# Altium schematic sheet Sheet1.SchDoc
size A; DrawnBy: John Ulm; DocumentNumber: Reciever; Revision: 1; SheetNumber: 1; SheetTotal: 1
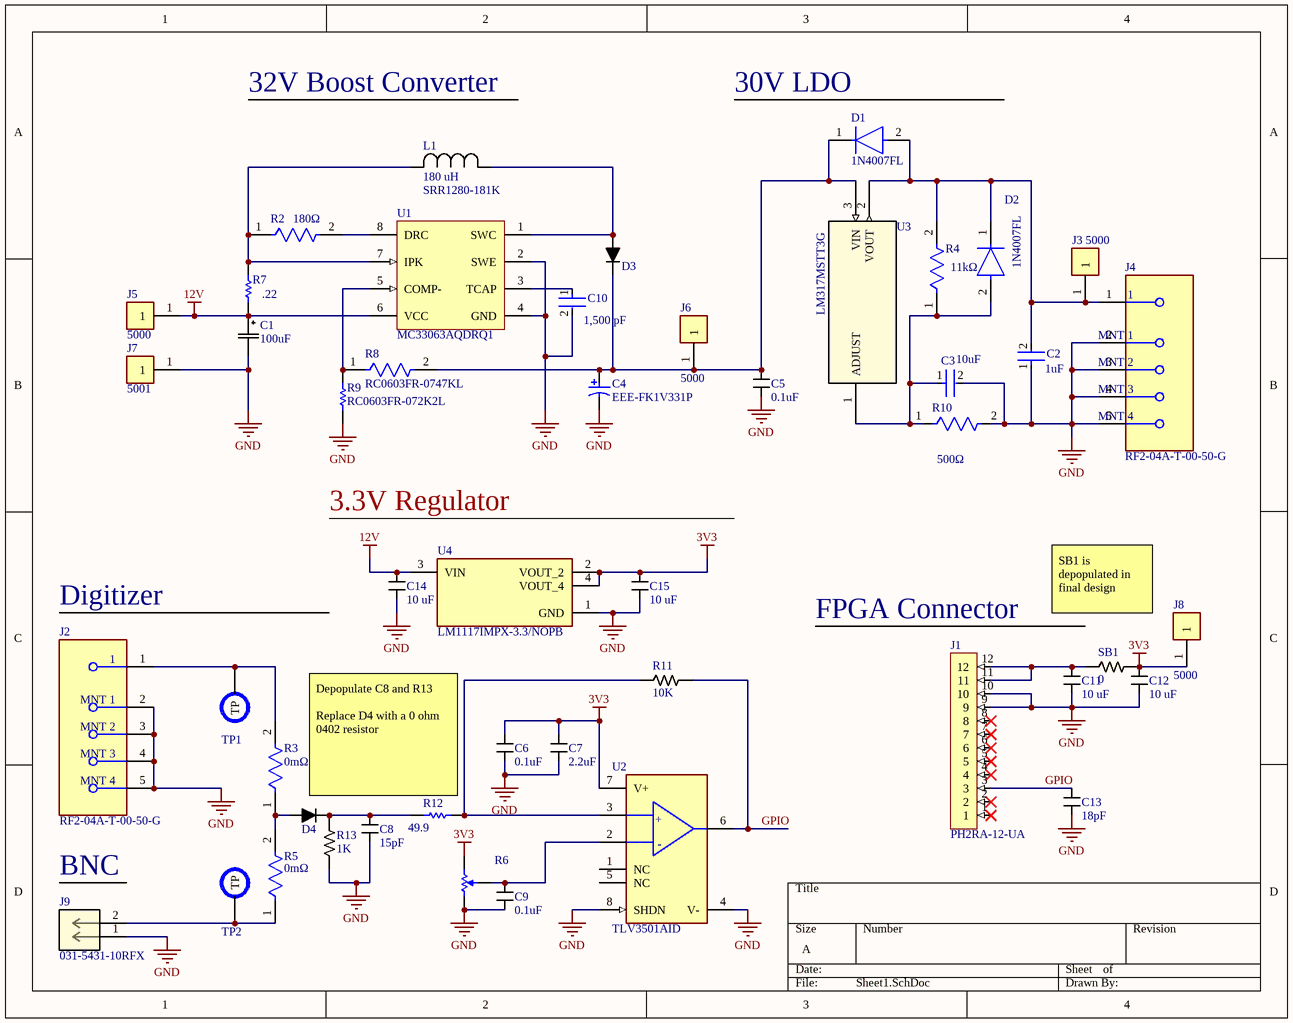
[diagram p0: Sheet1.SchDoc]

## Parts
C1  value 100uF  [PCAP_8x5.4-ELECT_NCA]  (hidden comment: 100uF electrolytic 35 V)
C2  Capacitance: 1uF  [FP-0603-L_1_6_0_1-W_0_8_0-IPC_A]  (hidden comment: UMK107BJ105KA-T)
C3  Capacitance: 10uF  [FP-GRM188-0_2-IPC_C]  (hidden comment: GRM188R6YA106MA73D)
C4  EEE-FK1V331P  [PNSC-EEE-FK1V331P_L]
C5  value 0.1uF  [CAPACITOR_0805]  (hidden comment: 100nF Ceramic 50V)
C6  value 0.1uF  [CAPACITOR_0603]  (hidden comment: 100nF Ceramic 25V)
C7  value 2.2uF  [CAPACITOR_0402]  (hidden comment: 2.2uF Ceramic 35V)
C8  value 15pF  [CAPACITOR_0402]  (hidden comment: 15pF Ceramic 50V)
C9  value 0.1uF  [CAPACITOR_0603]  (hidden comment: 100nF Ceramic 25V)
C10  value 1,500 pF  [FP-C0603C-CF-MFG]  (hidden comment: C0603C152F1GACTU)
C11  Value (uF): 10 uF  [CAPACITOR_0603]  (hidden comment: 10uF Ceramic 6.3V)
C12  Value (uF): 10 uF  [CAPACITOR_0603]  (hidden comment: 10uF Ceramic 6.3V)
C13  value 18pF  [CAPACITOR_0603]  (hidden comment: 18pF Ceramic 50V)
C14  Value (uF): 10 uF  [CAPACITOR_0603]  (hidden comment: 10uF Ceramic 6.3V)
C15  Value (uF): 10 uF  [CAPACITOR_0603]  (hidden comment: 10uF Ceramic 6.3V)
D1  1N4007FL  [FP-1N4007FL-MFG]
D2  1N4007FL  [FP-1N4007FL-MFG]
D3  STPS140Z  [SOD-123]  (value not drawn)
D4  BAR9002ELE6327XTMA1  [DIODE_0402]  (value not drawn)
J1  PH2RA-12-UA  [PH2RA-12-UA-Footprint-1]
J2  RF2-04A-T-00-50-G  [FP-RF2-04A-T-00-50-G-MFG]
J3  5000  [FP-5000-MFG]
J4  RF2-04A-T-00-50-G  [FP-RF2-04A-T-00-50-G-MFG]
J5  5000  [FP-5000-MFG]
J6  5000  [FP-5000-MFG]
J7  5001  [FP-5001-MFG]
J8  5000  [FP-5000-MFG]
J9  031-5431-10RFX  [031-5431-10RFX-Footprint-1]
L1  SRR1280-181K  value 180 uH  [SRR1280]
R2  Resistance: 180Ω  [FP-CRGCQ0603-IPC_C]  (hidden comment: CRGCQ0603F180R)
R3  Resistance: 0mΩ  [FP-RMCF0603-MFG]  (hidden comment: RMCF0603ZT0R00)
R4  Resistance: 11kΩ  [FP-ERA2A-MFG]  (hidden comment: ERA-2AEB113X)
R5  Resistance: 0mΩ  [FP-RMCF0603-MFG]  (hidden comment: RMCF0603ZT0R00)
R6  TC33X-2-103E  [BOUR-TC33X-2_V]  (value not drawn)
R7  value .22  [RESC1608X55X30NL15T15]  (hidden comment: ERJ-3RQFR22V)
R8  RC0603FR-0747KL  [FP-RC0603FR-0747KL-MFG]
R9  RC0603FR-072K2L  [RESC1608X55X25LL10T15]
R10  RT0603BRC07500RL  [RESC16080X45_RT0603-0_55_MFG]  (value not drawn)
R11  Value  (Ohms): 10K  [RESISTOR_0402]  (hidden comment: 10k Ohm 1% 1/16W)
R12  value 49.9  [RESC1005X40X25LL05T10]  (hidden comment: RC0402FR-0749R9L)
R13  Value  (Ohms): 1K  [RESISTOR_0603]  (hidden comment: 1k Ohm 5% 1/8W)
SB1  value 0  [RESISTOR_1206]  (hidden comment: JUMPER_0_1206)
TP1  PCB Test Point  [TESTPOINT_1.2MM]  (value not drawn)  (no BOM)
TP2  PCB Test Point  [TESTPOINT_1.2MM]  (value not drawn)  (no BOM)
U1  MC33063AQDRQ1  [D0008A_L]
U2  TLV3501AID  [FP-D0008A-IPC_C]
U3  LM317MSTT3G  [SOT223-3]
U4  LM1117IMPX-3.3/NOPB  [SOT-223-4]

## Nets
3V3: C6.1 C7.1 C12.1 C15.1 J8.1 R6.3 SB1.1 U2.7(V+) U4.2(VOUT_2) U4.4(VOUT_4)
12V: C1.1 C14.1 J5.1 R7.1 U1.6(VCC) U4.3(VIN)
GND: C1.2 C2.1 C3.2 C4.2 C5.2 C6.2 C7.2 C8.2 C9.2 C10.2 C11.2 C12.2 C13.2 C14.2 C15.2 J1.9 J1.10 J2.2(MNT_1) J2.3(MNT_2) J2.4(MNT_3) J2.5(MNT_4) J4.2(MNT_1) J4.3(MNT_2) J4.4(MNT_3) J4.5(MNT_4) J7.1 J9.1 R6.1 R9.1 R10.2 R13.2 U1.2(SWE) U1.4(GND) U2.4(V-) U2.8(SHDN) U4.1(GND)
GPIO: C13.1 J1.3 R11.1 U2.6(OUT)
NetC2_2: C2.2 D1.2(A) D2.1(C) J3.1 J4.1 R4.2 U3.2(VOUT)
NetC3_1: C3.1 D2.2(A) R4.1 R10.1 U3.1(ADJUST)
NetC4_1: C4.1 C5.1 D1.1(C) D3.2 J6.1 R8.2 U3.3(VIN)
NetC8_1: C8.1 D4.2 R12.1 R13.1
NetC9_1: C9.1 R6.2 U2.2(-IN)
NetC10_1: C10.1 U1.3(TCAP)
NetC11_1: C11.1 J1.11 J1.12 SB1.2
NetD3_1: D3.1 L1.1 U1.1(SWC)
NetD4_1: D4.1 R3.1 R5.2
NetJ2_1: J2.1 R3.2 TP1.TP
NetJ9_2: J9.2 R5.1 TP2.TP
NetL1_2: L1.2 R2.1 R7.2 U1.7(IPK)
NetR2_2: R2.2 U1.8(DRC)
NetR8_1: R8.1 R9.2 U1.5(COMP-)
NetR11_2: R11.2 R12.2 U2.3(+IN)

Not connected (* = marked no-connect by the designer): J1 1* 2* 4* 5* 6* 7* 8*; U2 1(NC) 5(NC)

## Notes on the sheet
- 32V Boost Converter
- (near D1) 30V LDO
- 3.3V Regulator
- Digitizer
- (near J1) FPGA Connector
- SB1 is depopulated in final design
- Depopulate C8 and R13
  Replace D4 with a 0 ohm 0402 resistor
- (near J9) BNC
- (in symbol CMP-04896-000133-1) +; -

## Library data of the parts
C1 = CAP ALUM 100UF 20% 35V SMD: 100 µF 35 V Aluminum Electrolytic Capacitors Radial, Can - SMD 1000 Hrs; Mfr_Name: Nichicon; Manufacturer_Part_Number: UCB1V0R1MCL1GS; Type: DEV; Made by: Tyson Nguyen; Copyright: Copyright (C) 2022 Ultra Librarian. All rights reserved.; RefDes: RefDes; Supplier 1: Mouser; Supplier Part Number 1: 667-EEE-FT1V101AP
C2 = CMP-2000-05447-3: None; Tolerance: 10%; Voltage Rating: 50V; Dielectric: X5R; Height: 0.8mm; Depth: 0.8mm; Number of Pins: 2; Length: 1.6mm; Thickness: 0.035inch; Contact Plating: Nickel; Radiation Hardening: No; Package Quantity: 1; Case/Package: 0603; Halogen Free: Halogen Free; RoHS Compliant: Yes; Termination: SMD/SMT; Max Operating Temperature: 85°C; Min Operating Temperature: -55°C; Case Code (Metric): 1608; Construction: Flat; Voltage Rating (DC): 50V; Packaging: Tape and Reel; Series: M; Case Code (Imperial): 0603; Width: 0.031inch; Mount: Surface Mount
C3 = CMP-06035-045466-1: Chip Multilayer Ceramic Capacitors for General Purpose, 0603, 10uF, X5R, 15%, 20%, 35V; Case Code (Imperial): 0603; Voltage Rating (DC): 35V; Width: 0.031inch; Dielectric: X5R; Voltage Rating: 35V; Min Operating Temperature: -55°C; Thickness: 0.039inch; Mount: Surface Mount; Case/Package: 0603; Length: 0.063inch; Max Operating Temperature: 85°C; Packaging: Tape and Reel; Tolerance: 20%; Case Code (Metric): 1608
C4 = CMP-2000-06212-1: Aluminum Electrolytic Capacitor, 330 uF, 35 V, -55 to 105 degC, 2-Pin CAPAE, RoHS, Tape and Reel; Manufacturer: Panasonic; Capacitance: 330µF; Type: Can; Impedance: 0.08O; Ripple Current: 850mA; Lifetime@Temperature: 2000Hrs@105°C; Rated Voltage: 35V; Datasheet Version: 07/2008; Manufacturer URL: http://www.panasonic.com/; Package Description: 2-Pin Capacitor Aluminum Electrolytic, Body 10.3 x 10.3 mm, Height 10.5 mm; Case Size/Dimension: Ø10x10.2mm; Datasheet URL: https://datasheet.ciiva.com/29313/443481-da-01-en-smd-elko-vfk-g-330-uf-35v-29313592.pdf; Series: FK; Mounting Technology: SurfaceMount; Package Reference: EEE-FK1V331P; Operating Temp-Max: 105°C; Operating Temp Range: -55to+105°C
C5 = CAPACITOR_0.1uF_0805: Cap 100nF 50V +/-10% / Ceramic 0805; Made By: Robert Pafford; Tolerance: +/- 10%; Voltage: 50V; Supplier 1: Newark; Supplier Part Number 1: 38AH3645
C6 C9 = CAPACITOR_0.1uF_0603_25V: Cap 100nF 25V +/-10% / Ceramic 0603; Voltage: 6.3V; Made By: Flip B; ComponentLink1Description: Datsheet; ComponentLink1URL: https://www.mouser.com/datasheet/2/212/KEM_C1002_X7R_SMD-1102033.pdf; Tolerance: +/- 10%; Supplier 1: Digikey; Supplier Part Number 1: 1276-1006-1-ND
C7 = CAPACITOR_2.2uF_0402: Cap 2.2uF 35V +/-10% / Ceramic 0402; Made By: Flip B; Tolerance: +/- 10%; Voltage: 35V; Supplier 1: Digi-Key; Supplier Part Number 1: 445-9028-1-ND
C8 = CAPACITOR_0.000015uF_0402: CAP CER 15PF 50V C0G/NP0 0402; Tolerance: +/- 5%; Made By: Robert Pafford; Voltage: 50V; Supplier 1: Newark; Supplier Part Number 1: 82AC9245
C10 = CMP-1035-01965-2: CAP CER 1500PF 100V NP0 0603; Manufacturer: KEMET; Material: Ceramic; Tolerance: 0.01; Automotive Grade: Grade 1; Temperature Coefficient: 30ppm/°C; Temperature Characteristic: C0G; Automotive: Yes; Temperature Range High: +125°C; ComponentLink2Description: Datasheet; Category: Cap; Octopart: https://octopart.com/c0603c152f1gactu-kemet-19049933; Device Class L1: Passive Components; Device Class L3: Ceramic Capacitors; Temperature: -55°C to +125°C; Mouser Description: Multilayer Ceramic Capacitors MLCC - SMD/SMT 100volts 1500pF 1% C0G; Package: C0603C-CF; Device Class L2: Capacitors; Height: 0.87mm; Digikey Description: CAP CER 1500PF 100V NP0 0603; Temperature Range Low: -55°C; Lead Free: Yes; Voltage Rating: 100 V; RoHS: TRUE; Capacitance: 1,500 pF; Manufacturer Part Number: C0603C152F1GACTU; ComponentLink2URL: https://api.kemet.com/component-edge/download/datasheet/C0603C100J5GACAUTO.pdf
C11 C12 C14 C15 = CAPACITOR_10uF_0603: Cap 10uF 6.3V +/-20% / Ceramic 0603; Made By: Flip B; ComponentLink1Description: Digikey; ComponentLink1URL: https://www.digikey.com/en/products/detail/samsung-electro-mechanics/CL10A106MQ8NNNC/3886777; Supplier 1: Digi-Key; Supplier Part Number 1: 1276-1119-1-ND; Tolerance: +/- 20%; Voltage: 6.3V
C13 = CAPACITOR_0.000018uF_0603: Cap 18pF 50V +/-5% / Ceramic 0603; Made By: Flip B; ComponentLink1Description: Datsheet; ComponentLink1URL: https://www.mouser.com/datasheet/2/212/KEM_C1002_X7R_SMD-1102033.pdf; Tolerance: +/- 5%; Voltage: 50V; Supplier 1: Digi-Key; Supplier Part Number 1: 311-1061-1-ND
D1 D2 = CMP-10078-122641204-1: 1N4007FL Diode Gen Purp 1KV 1A SOD123FL; Capacitance: 6pF; Max Junction Temperature (Tj): 150°C; Peak Reverse Current: 5µA; Max Forward Surge Current (Ifsm): 30A; Reverse Voltage: 1kV; Max Operating Temperature: 150°C; Height: 1.1mm; Min Operating Temperature: -55°C; Forward Current: 1A; Max Repetitive Reverse Voltage (Vrrm): 1kV; NexarPartId: 122641204
D3 = STPS140Z: DIODE SCHOTTKY 40V 1A SOD123; Supplier 1: DigiKey; Supplier Part Number 1: 497-7546-1-ND
D4 = RF Diode 80V 100mA: RF Diode PIN - Single 80V 100 mA 250 mW PG-TSLP-2-19; Forward Current: 100mA; Voltage - Peak Reverse: 80V; Package: 0402
J1 = CMP-002-00071-1: Conn Unshrouded Header HDR 12 POS 2.54mm Solder RA Top Entry Thru-Hole Bag; Min Operating Temperature: -40°C; Max Operating Temperature: 105°C; Pins: 12
J2 J4 = CMP-42753-000002-1: CONN SMA JACK STR 50 OHM PCB
J3 J5 J6 J8 = CMP-002-00074-1: Cable Wrap, 1/2 Inch, Polyethylene, Natural, 50 Ft, Spirap Series; Mounting Technology: PCB, Through Hole
J7 = CMP-002-00076-1: Test Point, Mini, Thm, Pc, .300 L, .100 Od, Heat Resistant Nylon 46, Black; Pins: 1; Mounting Technology: PCB, Through Hole
J9 = CMP-002-00073-1: RF BNC Connector, Female, Panel Mount, Board And Panel Mount, Solder Terminal, Jack; Voltage Rating: 500V; Connector Type: Receptacle; Gender: Male; Mounting Technology: Bulkhead, PCB, Panel, Through Hole; Max Operating Temperature: 85°C; Min Operating Temperature: -55°C
L1 = SRR1280-181K: FIXED IND 180UH 1.75A 300 MOHM; Supplier 1: DigiKey; Supplier Part Number 1: SRR1280-181KCT-ND; R: 300 mOhm
R2 = CMP-03211-005520-1: CRGCQ 0603 180R 1%; Manufacturer: TE Connectivity; Power Rating: 0.1W; Tolerance: 0.01; Voltage Rating: 75V; Temperature Coefficient: ±100ppm/°C; Value: 180Ω; Device Class L1: Passive Components; Category: Res; RoHS: TRUE; Octopart: https://octopart.com/crgcq0603f180r-te+connectivity-91018047; Ipc Land Pattern Name: RESC16080X45; Digikey Description: CRGCQ 0603 180R 1%; Ambient Temperature Range High: +70°C; Device Class L2: Resistors; Composition: Thick Film; Lead Free: Yes; Temperature: -55°C to +155°C; ComponentLink2Description: Datasheet; Manufacturer Part Number: CRGCQ0603F180R; Height: 0.55mm; Device Class L3: Chip SMD Resistors; Package: CRGCQ0603; Temperature Range High: +155°C; ComponentLink2URL: https://www.te.com/commerce/DocumentDelivery/DDEController?Action=showdoc&DocId=Data+Sheet%7F1773204-3%7F1%7Fpdf%7FEnglish%7FENG_DS_1773204-3_1.pdf%7F4-2176339-520; Series: CRGCQ; Temperature Range Low: -55°C
R3 R5 = CMP-26527-000011-1: RES 0 OHM JUMPER 1/10W 0603; Manufacturer: Stackpole; Power Rating: 0.1W; Voltage Rating: 75V; Automotive Grade: Grade 0; Value: 0mΩ; Series: RMCF; Manufacturer Part Number: RMCF0603ZT0R00; Device Class L1: Passive Components; Device Class L3: Chip SMD Resistors; Octopart: https://octopart.com/rmcf0603zt0r00-stackpole+electronics-19213618; Temperature: -55°C to +155°C; Lead Free: Yes; ComponentLink2URL: https://www.seielect.com/catalog/sei-rmcf_rmcp.pdf; Height: 0.55mm; Composition: Thick Film; Package: RMCF0603; Automotive: Yes; Temperature Range High: +155°C; Ipc Land Pattern Name: RESC15580X45; Digikey Description: RES 0 OHM JUMPER 1/10W 0603; RoHS: TRUE; ComponentLink2Description: Datasheet; Temperature Range Low: -55°C; Category: Res; Device Class L2: Resistors
R4 = CMP-2002-05776-2: NexarPartId: 42798195; Voltage Rating: 25V; Power Rating: 63mW; Tolerance: 0.1%; Temperature Coefficient: 25ppm/°C; Packaging: Cut Tape; Radiation Hardening: No; Width: 500µm; Lead Free: Lead Free; Features: Automotive AEC-Q200; Max Power Dissipation: 63mW; Height: 406.4µm; REACH SVHC: No SVHC; Number of Terminations: 2; Case Code (Imperial): 0402; Lifecycle Status: Production; Length: 1mm; Contact Plating: Tin; RoHS: Compliant; Schedule B: 8533210045, 8533210045; Mount: Surface Mount; Voltage Rating (DC): 25V; Min Operating Temperature: -55°C; Case Code (Metric): 1005; Military Standard: Not; Composition: Metal Film, Thin Film; Case/Package: 0402; Depth: 500µm; Max Operating Temperature: 155°C
R6 = CMP-009-00060-2: Trimming Potentiometer, 10000 Ohm, -40 to 100 degC, 3-Pin SMD, RoHS, Tape and Reel; Manufacturer: Bourns; Tolerance: 25%; Power: 100mW; Resistance: 10k; Max Operating Temperature: 120°C; Package Description: 3-Pin Surface Mount Device, Body 3.8 x 3.6 mm; Datasheet Version: Aug-16; RoHS Compliant: True; Mounting Technology: SM; Package Quantity: 2500; Manufacturer URL: http://www.bourns.com/; Datasheet URL: http://www.bourns.com/docs/Product-Datasheets/TC33.pdf; Case/Package: TC33X-2; Package Reference: TC33X-2; Composition: Potentiometer; Packaging: TapeandReel; Min Operating Temperature: -40°C
R7 = CMP-2000-00853-1: Manufacturer: Panasonic; Part Number: ERJ-3RQFR22V
R8 = CMP-1659-00055-2: RES SMD 47K OHM 1% 1/10W 0603; Voltage Rating: 50V; Temperature Coefficient: 100ppm/°C; Max Power Dissipation: 100mW; Resistance: 47kR; Voltage Rating (DC): 50V; Min Operating Temperature: -55°C; Packaging: Tape and Reel; Features: Moisture Resistant; Termination: SMD/SMT; Technology: THICK FILM; Lead Free: Lead Free; Max Operating Temperature: 155°C; Width: 0.031inch; Case Code (Metric): 1608; Tolerance: 1%; Package Quantity: 1; Resistor Type: Thick Film; RoHS Compliant: Yes; Case/Package: 0603; Case Code (Imperial): 0603; Resistance Tolerance: 1%; Length: 0.063inch; Series: RC; Number of Pins: 2; Power Rating: 100mW; Number of Terminations: 2; Construction: Rectangular; Height: 0.022inch; Military Standard: Not; Size Code: 0603; Depth: 0.8mm
R9 = CMP-2000-06934-1: Thick Film Resistor, 2.2 KOhm, 100 mW, 50 V, +/- 1%, -55 to 155 degC, 2-Pin SMD (0603), RoHS, Tape and Reel; Manufacturer: Yageo; Resistance: 2.2kOhms; Temperature Coefficient: 100PPM/C; Voltage Rating: 50V; Power Rating: 100mW; Tolerance: 1%; Datasheet Version: Rev. 7, 05/2017; Case Code - mm: 1608; Series: RC; Mounting Technology: SurfaceMount; Package Description: 2-Pin Surface Mount Device, Body 1.6 x 0.8 mm; Case Code - in: 0603; Package Reference: 0603; Product: ThickFilmResistorsGeneralPurpose; Manufacturer URL: http://www.yageo.com/; Termination Style: SMD/SMT; Operating Temperature Range: -55Cto+155C; Datasheet URL: http://www.yageo.com/documents/recent/PYu-RC_Group_51_RoHS_L_7.pdf; Packaging: Reel
R10 = CMP-00621-87214386-1: Fixed Resistor, Thin Film, 0.1W, 500ohm, 75V, 0.1% +/-Tol, 15ppm/Cel, Surface Mount, 0603; Temperature Coefficient: 15ppm/°C; Power Rating: 100mW; Resistance: 500Ω; ComponentLink1URL: http://www.yageo.com/; Min Operating Temperature: -55°C; ComponentLink1Description: Manufacturer URL; Tolerance: 0.1%; ComponentLink3URL: http://www.yageo.com/exep/pages/download/literatures/PYu-R_Mount_10.pdf; RoHS: Non-Compliant; Voltage Rating: 75V; Max Operating Temperature: 155°C; Height: 550µm; ComponentLink2URL: https://www.yageo.com/upload/media/product/productsearch/datasheet/rchip/PYu-RT_1-to-0.01_RoHS_L_15.pdf; Case/Package: 0603; Packaging: Tape & Reel; ComponentLink3Description: Package URL; Composition: Thin Film; ComponentLink2Description: Datasheet URL
R11 = RESISTOR_10K_0402: RES 10k OHM 1% 1/16W 0402; Tolerance: +/- 1%; Made By: Robert Pafford; Wattage: 1/16W; Supplier: Digikey; Digikey Part Numer: CR0603-JW-104ELFTR-ND; Supplier 1: Digi-Key; Supplier Part Number 1: YAG3436CT-ND
R12 = CMP-2002-07709-1: Manufacturer: Yageo / Phycomp; Part Number: RC0402FR-0749R9L
R13 = RESISTOR_1K_0603: RES 1k OHM 5% 1/8W 0603; Tolerance: +/- 5%; Made By: Robert Pafford; ComponentLink1Description: Datasheet; ComponentLink1URL: https://www.bourns.com/docs/product-datasheets/CRxxxxx.pdf; Wattage: 1/8W; Supplier: Digikey; Digikey Part Numer: CR0603-JW-104ELFTR-ND; Supplier 1: Digi-Key; Supplier Part Number 1: 2019-RK73B1JTTD102JCT-ND
SB1 = JUMPER_0_1206: JUMPER 0OHM 1206
TP1 TP2 = TESTPOINT: Made By: Robert Pafford
U1 = CMP-0344-00012-2: Inverting Buck-Boost Regulator with 3 to 40 V Input and 1.25 to 40 V Output, -40 to 125 degC, 8-Pin SOIC (D), Green (RoHS & no Sb/Br); Manufacturer: Texas Instruments; Vin(Min)(V): 3; Regulated Outputs(#): 1; Switching Frequency(Max)(kHz): 100; Vout(Max)(V): 40; Switch Current Limit(Typ)(A): 1.5; SubFamily: Inverting Regulator; Vout(Min)(V): 1.25; DatasheetVersion: SLLS654B; PackageVersion: revM, Jun-2011; ComponentLink1Description: Datasheet; Vin(Max)(V): 40; PackageReference: D0008A; ComponentLink2URL: http://www.ti.com/litv/pdf/msoi002j; Mounting Technology: Surface Mount; PartNumber: MC33063AQDRQ1; ComponentLink1URL: http://www.ti.com/general/docs/lit/getliterature.tsp?genericPartNumber=MC33063A-Q1&fileType=pdf; Topology: Inverting Buck-Boost; ComponentLink2Description: Package Specification; PackageDescription: 8-Pin Plastic Small Outline Integrated Circuit, 4.9 x 3.9 mm, Pitch 1.27 mm Pitch; Code_JEDEC: MS-012AA; Eco-Plan: Green (RoHS & no Sb/Br)
U2 = CMP-04896-000133-1: IC COMPARATOR 4.5NS R-R HS 8SOIC; Max Supply Voltage: 5.5V; Operating Supply Current: 5mA; Input Offset Voltage (Vos): 6.5mV; Common Mode Rejection Ratio: 70dB; Propagation Delay: 10ns; Number of Elements: 1; Hysteresis: 6mV; Min Supply Voltage: 2.7V; Input Bias Current: 10pA; Supply Type: Single; Nominal Supply Current: 3.2mA; Output Type: TTL; Power Supply Rejection Ratio (PSRR): 100dB; Output Current: 74mA; Min Operating Temperature: -40°C; Lead Free: Lead Free; Weight: 0.002677oz; Number of Pins: 8; Length: 4.9mm; RoHS Compliant: Yes; Case/Package: SOIC; Quiescent Current: 5mA; Package Quantity: 75; Response Time: 4.5ns; Max Operating Temperature: 125°C; Width: 3.91mm; Radiation Hardening: No; Packaging: Rail/Tube; Mount: Surface Mount; Type: General Purpose; REACH SVHC: No SVHC; Height: 1.58mm; Number of Channels: 1
U3 = LM317MSTT3G: Linear Voltage Regulator IC Positive Adjustable 1 Output 500mA SOT-223 (TO-261); Supplier 1: DigiKey; Supplier Part Number 1: LM317MSTT3GOSCT-ND
U4 = LM1117IMPX-3.3/NOPB: 800-mA 15-V linear voltage regulator 4-SOT-223 -40 to 125; MF: Texas Instruments; Texas_Instruments-Purchase-URL: https://snapeda.com/shop?store=Texas+Instruments&id=410186; Price: None; Mouser-Purchase-URL: https://snapeda.com/shop?store=Mouser&id=410186; MP: LM1117IMPX-3.3/NOPB; Value: *; Availability: Good; Package: SOT-223-4 Texas Instruments; Arrow_Electronics-Purchase-URL: https://snapeda.com/shop?store=Arrow+Electronics&id=410186; SnapEDA_Link: https://www.snapeda.com/parts/LM1117IMPX-3.3/NOPB/Texas%20Instruments/view-part/410186/?ref=snap; DigiKey-Purchase-URL: https://snapeda.com/shop?store=DigiKey&id=410186